# Altium schematic sheet SODIMMSch.schdoc: DIMM 1V8 CB Top Sheet
size A4; SheetNumber: 1; SheetTotal: 2
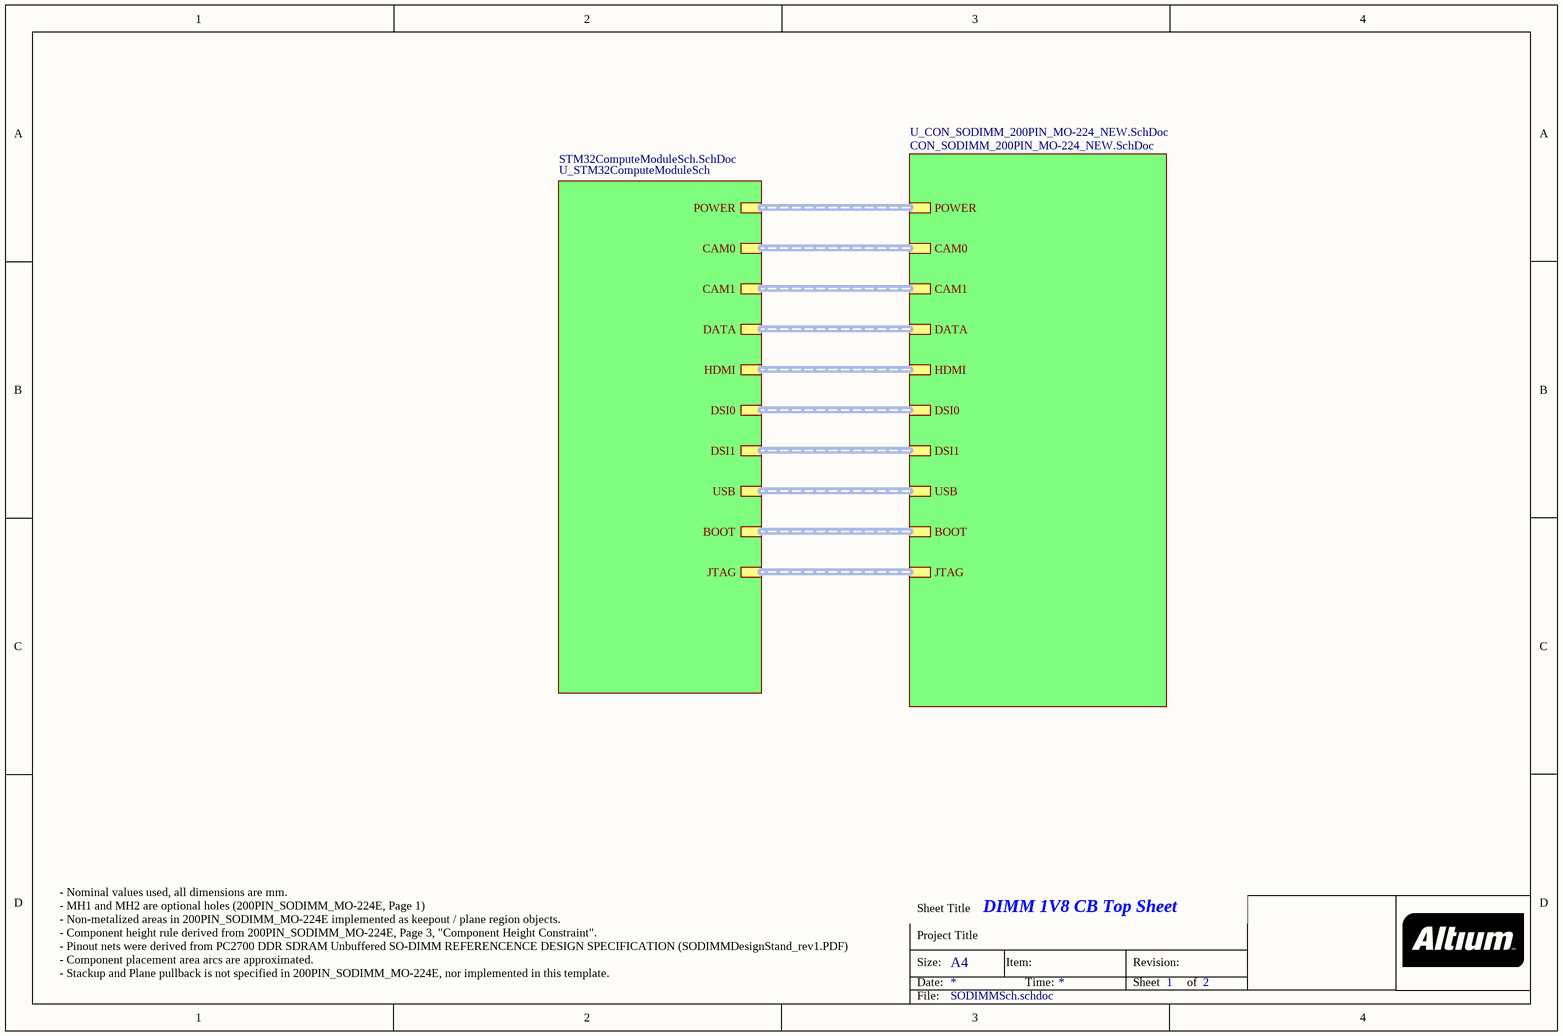
[diagram p0: SODIMMSch.schdoc]

## Sub-sheets
U_CON_SODIMM_200PIN_MO-224_NEW.SchDoc = CON_SODIMM_200PIN_MO-224_NEW.SchDoc: POWER (harness SODIMM_MO-224_POWER), HDMI (harness SODIMM_MO-224_HDMI), USB (harness SODIMM_MO-224_USB), BOOT (harness SODIMM_MO-224_BOOT), JTAG (harness SODIMM_MO-224_JTAG), CAM0 (harness SODIMM_MO-224_CAM0), CAM1 (harness SODIMM_MO-224_CAM1), DATA (harness SODIMM_MO-224_DATA), DSI0 (harness SODIMM_MO-224_DSI0), DSI1 (harness SODIMM_MO-224_DSI1)
U_STM32ComputeModuleSch = STM32ComputeModuleSch.SchDoc: POWER (harness SODIMM_MO-224_POWER), HDMI (harness SODIMM_MO-224_HDMI), CAM0 (harness SODIMM_MO-224_CAM0), CAM1 (harness SODIMM_MO-224_CAM1), DATA (harness SODIMM_MO-224_DATA), DSI0 (harness SODIMM_MO-224_DSI0), DSI1 (harness SODIMM_MO-224_DSI1), USB (harness SODIMM_MO-224_USB), BOOT (harness SODIMM_MO-224_BOOT), JTAG (harness SODIMM_MO-224_JTAG)

## Buses and harness runs
harness sheet U_CON_SODIMM_200PIN_MO-224_NEW.SchDoc/BOOT = sheet U_STM32ComputeModuleSch/BOOT
harness sheet U_CON_SODIMM_200PIN_MO-224_NEW.SchDoc/CAM0 = sheet U_STM32ComputeModuleSch/CAM0
harness sheet U_CON_SODIMM_200PIN_MO-224_NEW.SchDoc/CAM1 = sheet U_STM32ComputeModuleSch/CAM1
harness sheet U_CON_SODIMM_200PIN_MO-224_NEW.SchDoc/DATA = sheet U_STM32ComputeModuleSch/DATA
harness sheet U_CON_SODIMM_200PIN_MO-224_NEW.SchDoc/DSI0 = sheet U_STM32ComputeModuleSch/DSI0
harness sheet U_CON_SODIMM_200PIN_MO-224_NEW.SchDoc/DSI1 = sheet U_STM32ComputeModuleSch/DSI1
harness sheet U_CON_SODIMM_200PIN_MO-224_NEW.SchDoc/HDMI = sheet U_STM32ComputeModuleSch/HDMI
harness sheet U_CON_SODIMM_200PIN_MO-224_NEW.SchDoc/JTAG = sheet U_STM32ComputeModuleSch/JTAG
harness sheet U_CON_SODIMM_200PIN_MO-224_NEW.SchDoc/POWER = sheet U_STM32ComputeModuleSch/POWER
harness sheet U_CON_SODIMM_200PIN_MO-224_NEW.SchDoc/USB = sheet U_STM32ComputeModuleSch/USB

## Notes on the sheet
- - Nominal values used, all dimensions are mm.
  - MH1 and MH2 are optional holes (200PIN_SODIMM_MO-224E, Page 1)
  - Non-metalized areas in 200PIN_SODIMM_MO-224E implemented as keepout / plane region objects.
  - Component height rule derived from 200PIN_SODIMM_MO-224E, Page 3, "Component Height Constraint".
  - Pinout nets were derived from PC2700 DDR SDRAM Unbuffered SO-DIMM REFERENCENCE DESIGN SPECIFICATION (SODIMMDesignStand_rev1.PDF)
  - Component placement area arcs are approximated.
  - Stackup and Plane pullback is not specified in 200PIN_SODIMM_MO-224E, nor implemented in this template.
- Sheet Title
- Project Title
- Size:
- Date:
- A4
- Item:
- Time:
- Revision:
- Sheet
- of
- File: